# Altium project do_an2.PrjPcb
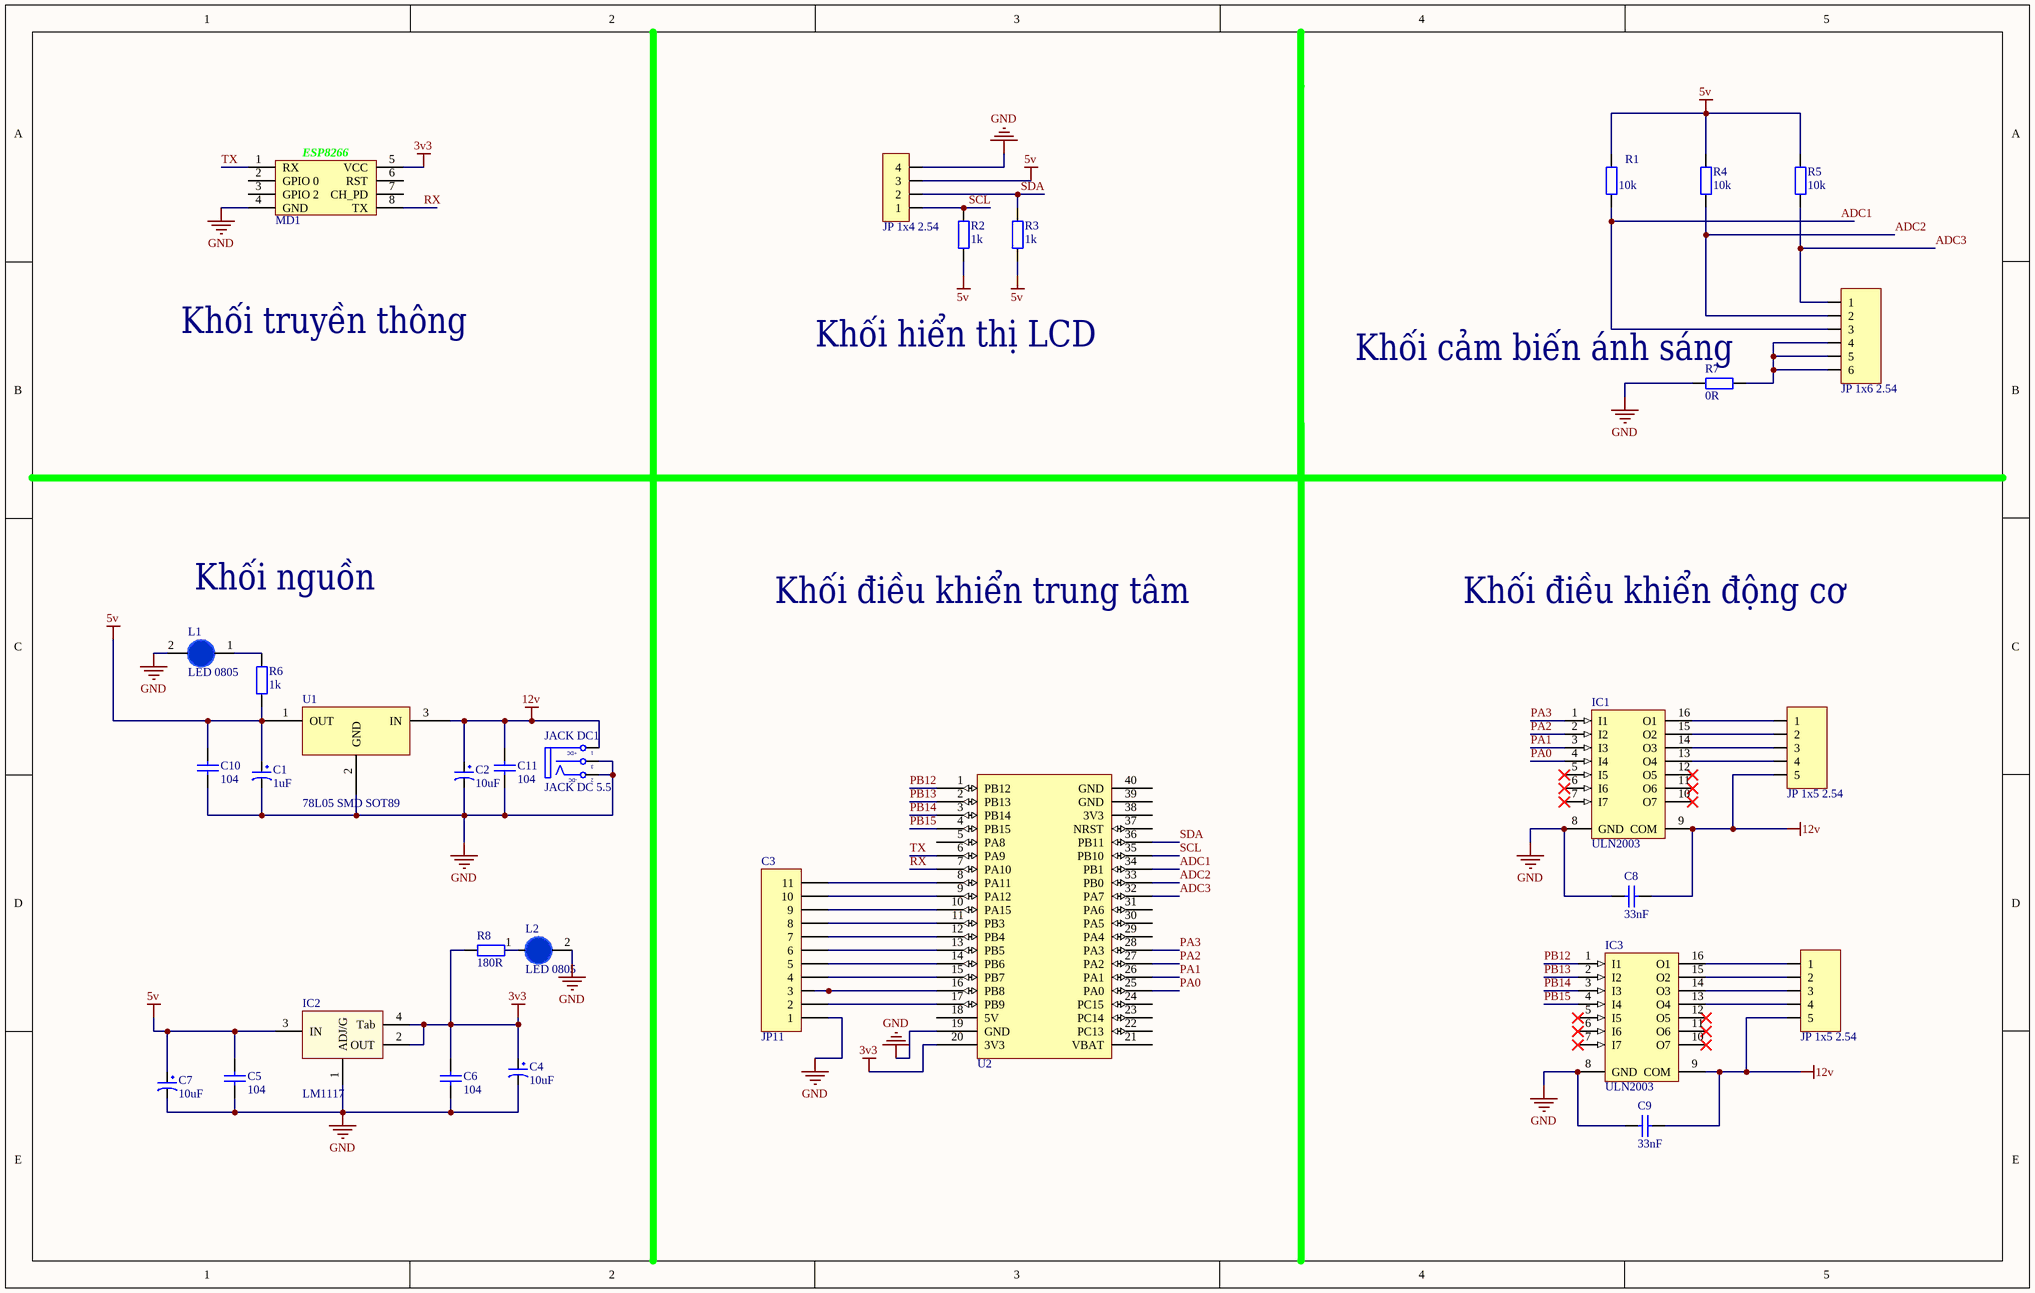
[diagram p0: do_an2.SchDoc]
1 sheet, 32 parts. Net scope: global (net labels, ports and power ports of the same name join across sheets).
Board file: PCBdo_an2.PcbDoc

## Sheet do_an2.SchDoc
size 381 x 241 mm; SheetNumber: 1; SheetTotal: 1

### Parts
C1  1uF  [tu hoa 5mm]
C2  10uF  [tu hoa 4mm]
C3  JP11  [JP11-C1T]
C4  10uF  [tu hoa 4mm]
C5  104  [tu 0805]
C6  104  [tu 0805]
C7  10uF  [tu hoa 4mm]
C8  33nF  [tu 0805]
C9  33nF  [tu 0805]
C10  104  [tu 0805]
C11  104  [tu 0805]
IC1  ULN2003  [SOP 16]
IC2  LM1117  [SOT223-4N]
IC3  ULN2003  [SOP 16]
JACK_DC1  JACK DC 5.5  [JACK DC 5.5]
JP1  JP 1x4 2.54  [JP 1x4 CC]
JP2  JP 1x6 2.54  [JP 1x6 CT]
JP3  JP 1x5 2.54  [JP 1x5 DT]
JP4  JP 1x5 2.54  [JP 1x5 DT]
L1  LED 0805  [LED-0805-Blue]
L2  LED 0805  [LED-0805-Blue]
MD1  ESP8266 Module  [ESP2866 Module]  (value not drawn)
R1  10k  [tro smd 0805]
R2  1k  [tro smd 0805]
R3  1k  [tro smd 0805]
R4  10k  [tro smd 0805]
R5  10k  [tro smd 0805]
R6  1k  [tro smd 0805]
R7  0R  [tro smd 0805]
R8  180R  [tro smd 0805]
U1  78L05 SMD SOT89  [SOT89]
U2  STM32 BluePill  [STM32 Bluepill]  (value not drawn)

### Nets
3v3: C4.1 C6.1 IC2.2(OUT) IC2.4(Tab) MD1.5(VCC) R8.1 U2.20(3V3)
5v: C1.1 C5.1 C7.1 C10.1 IC2.3(IN) JP1.3 R1.2 R2.1 R3.1 R4.2 R5.2 R6.2 U1.1(OUT)
12v: C2.1 C8.1 C9.1 C11.1 IC1.9(COM) IC3.9(COM) JACK_DC1.1(T) JP3.5 JP4.5 U1.3(IN)
GND: C1.2 C2.2 C3.1 C4.2 C5.2 C6.2 C7.2 C8.2 C9.2 C10.2 C11.2 IC1.8(GND) IC2.1(ADJ/G) IC3.8(GND) JACK_DC1.2(TN) JACK_DC1.3(S) JP1.4 L1.2(K) L2.2(K) MD1.4(GND) R7.1 U1.2(GND) U2.19(GND)
ADC1: JP2.3 R1.1 U2.34(PB1)
ADC2: JP2.2 R4.1 U2.33(PB0)
ADC3: JP2.1 R5.1 U2.32(PA7)
PA0: IC1.4(I4) U2.25(PA0)
PA1: IC1.3(I3) U2.26(PA1)
PA2: IC1.2(I2) U2.27(PA2)
PA3: IC1.1(I1) U2.28(PA3)
PB12: IC3.1(I1) U2.1(PB12)
PB13: IC3.2(I2) U2.2(PB13)
PB14: IC3.3(I3) U2.3(PB14)
PB15: IC3.4(I4) U2.4(PB15)
RX: MD1.8(TX) U2.7(PA10)
SCL: JP1.1 R2.2 U2.35(PB10)
SDA: JP1.2 R3.2 U2.36(PB11)
TX: MD1.1(RX) U2.6(PA9)
NetC3_2: C3.2 U2.17(PB9)
NetC3_3: C3.3 U2.16(PB8)
NetC3_4: C3.4 U2.15(PB7)
NetC3_5: C3.5 U2.14(PB6)
NetC3_6: C3.6 U2.13(PB5)
NetC3_7: C3.7 U2.12(PB4)
NetC3_8: C3.8 U2.11(PB3)
NetC3_9: C3.9 U2.10(PA15)
NetC3_10: C3.10 U2.9(PA12)
NetC3_11: C3.11 U2.8(PA11)
NetIC1_13: IC1.13(O4) JP3.4
NetIC1_14: IC1.14(O3) JP3.3
NetIC1_15: IC1.15(O2) JP3.2
NetIC1_16: IC1.16(O1) JP3.1
NetIC3_13: IC3.13(O4) JP4.4
NetIC3_14: IC3.14(O3) JP4.3
NetIC3_15: IC3.15(O2) JP4.2
NetIC3_16: IC3.16(O1) JP4.1
NetJP2_4: JP2.4 JP2.5 JP2.6 R7.2
NetL1_1: L1.1(A) R6.1
NetL2_1: L2.1(A) R8.2

Not connected (* = marked no-connect by the designer): IC1 5(I5)* 6(I6)* 7(I7)* 10(O7)* 11(O6)* 12(O5)*; IC3 5(I5)* 6(I6)* 7(I7)* 10(O7)* 11(O6)* 12(O5)*; MD1 2(GPIO_0) 3(GPIO_2) 6(RST) 7(CH_PD); U2 5(PA8) 18(5V) 21(VBAT) 22(PC13) 23(PC14) 24(PC15) 29(PA4) 30(PA5) 31(PA6) 37(NRST) 38(3V3) 39(GND) 40(GND)

### Notes on the sheet
- Khối truyền thông
- Khối hiển thị LCD
- (near R7) Khối cảm biến ánh sáng
- Khối nguồn
- Khối điều khiển trung tâm
- Khối điều khiển động cơ
- (in symbol ESP8266 Module) ESP8266
- (in symbol JACK DC 5.5) +DC; -DC

### Library data of the parts
C1 = Tu Hoa 1uF 50V 5x11: Cắm; Don_Vi: Con; So_Chan: 2; Ten_Linh_Kien: Tụ Hóa 1uF 50V 5x11MM; Ma_Hang: MH001355; Chung_Loai: Cắm; Kieu_Chan: *
C2 C4 C7 = Tu Hoa 10uF 16V 4x7: Cắm; So_Chan: 2; Don_Vi: Con; Ten_Linh_Kien: Tụ Hóa 10uF 16V; Ma_Hang: MH006855; Chung_Loai: Cắm; Kieu_Chan: *
C3 = JP11: WR-PHD 2.54 mm Angled Socket Header; Manufacturer: W¨¹rth Elektronik eiSos GmbH; partNo: 613011143121; ComponentLink1 Description: Manufacturer; ComponentLink2 Description: Datasheet; NoPins: 11; Created Date: 29 March 2013; ComponentLink1URL: http://www.we-online.com; ComponentLink2URL: http://katalog.we-online.de/em/datasheet/6130xx143121.pdf; Created by: Karrer Zheng
C5 C6 C10 C11 = Tu 0805 104 50V 10%: Dán; Don_Vi: Con; So_Chan: 2; Ten_Linh_Kien: Tụ 0805 104-100nF 10% 50V; Ma_Hang: MH004551; Chung_Loai: Dán; Kieu_Chan: *
C8 C9 = Tu 0805 33nF 50V 20%: Dán; Don_Vi: Con; So_Chan: 2; Ten_Linh_Kien: Tụ 0805 33nF 50V 20%; Ma_Hang: MH007854; Kieu_Chan: *; Chung_Loai: Dán
IC1 IC3 = ULN2003A SMD: Dán; Ten_Linh_Kien: ULN2003 SOP16; Don_Vi: Con; Ma_Hang: MH002408; Ghi_Chu: *; Chung_Loai: Dán; Kieu_Chan: *
IC2 = LM1117: 3v3; Value: LM317
JACK_DC1 = JACK DC 5.5: Value: Jac DC
JP1 = JP 1x4 2.54 Cai Cong: Cắm; Ten_Linh_Kien: Jump Đơn Cái 2.54MM 1x40P Cong; Don_Vi: Con; Ma_Hang: MH001265; Ghi_Chu: *; Kieu_Chan: *; Chung_Loai: Cắm
JP2 = JP 1x6 2.54 Cai Thang: Cắm; Ten_Linh_Kien: Jump Đơn Cái 2.54MM 1x20P Thẳng; Don_Vi: Con; Ma_Hang: MH004006; Ghi_Chu: *; Kieu_Chan: *; Chung_Loai: Cắm
JP3 JP4 = JP 1x5 2.54 Duc Thang: Cắm; Ten_Linh_Kien: Jump Đơn Đực 2.54MM 1x40P Thẳng 11MM; Don_Vi: Con; Ma_Hang: MH000903; Ghi_Chu: *; Kieu_Chan: *; Chung_Loai: Cắm
L1 L2 = LED 0805 Xanh Duong: Dán; Don_Vi: Con; Ma_Hang: MH002327; Ten_Linh_Kien: LED 0805 Màu Xanh Dương (Blue); Ghi_Chu: *; Kieu_Chan: *; Chung_Loai: Dán
R1 R4 R5 = Tro 0805 5% 10k: Dán; Don_Vi: Con; So_Chan: 2; Ten_Linh_Kien: Trở 0805 5% 10k; Ma_Hang: MH005239; Chung_Loai: Dán; Kieu_Chan: *
R2 R3 = Tro 0805 1% 1k: Dán; Don_Vi: Con; So_Chan: 2; Ten_Linh_Kien: Trở 0805 1% 1k; Ma_Hang: MH005468; Chung_Loai: Dán; Kieu_Chan: *
R6 = Tro 0805 5% 1k: Dán; Don_Vi: Con; So_Chan: 2; Ten_Linh_Kien: Trở 0805 5% 1k; Ma_Hang: MH005234; Chung_Loai: Dán; Kieu_Chan: *
R7 = Tro 0805 5% 0R: Dán; Don_Vi: Con; So_Chan: 2; Ten_Linh_Kien: Trở 0805 5% 0R; Ma_Hang: MH005230; Chung_Loai: Dán; Kieu_Chan: *
R8 = Tro 0805 5% 180R: Dán; Don_Vi: Con; So_Chan: 2; Ten_Linh_Kien: Trở 0805 5% 180R; Ma_Hang: MH005256; Chung_Loai: Dán; Kieu_Chan: *
U1 = 78L05 SMD SOT89: Dán; Ten_Linh_Kien: 78L05 SOT89 0.1A 5V; Don_Vi: Con; Ma_Hang: MH004845; Ghi_Chu: *; Kieu_Chan: *; Chung_Loai: Dán
U2 = STM32 BluePill: STM32F103C8T6 breakout board